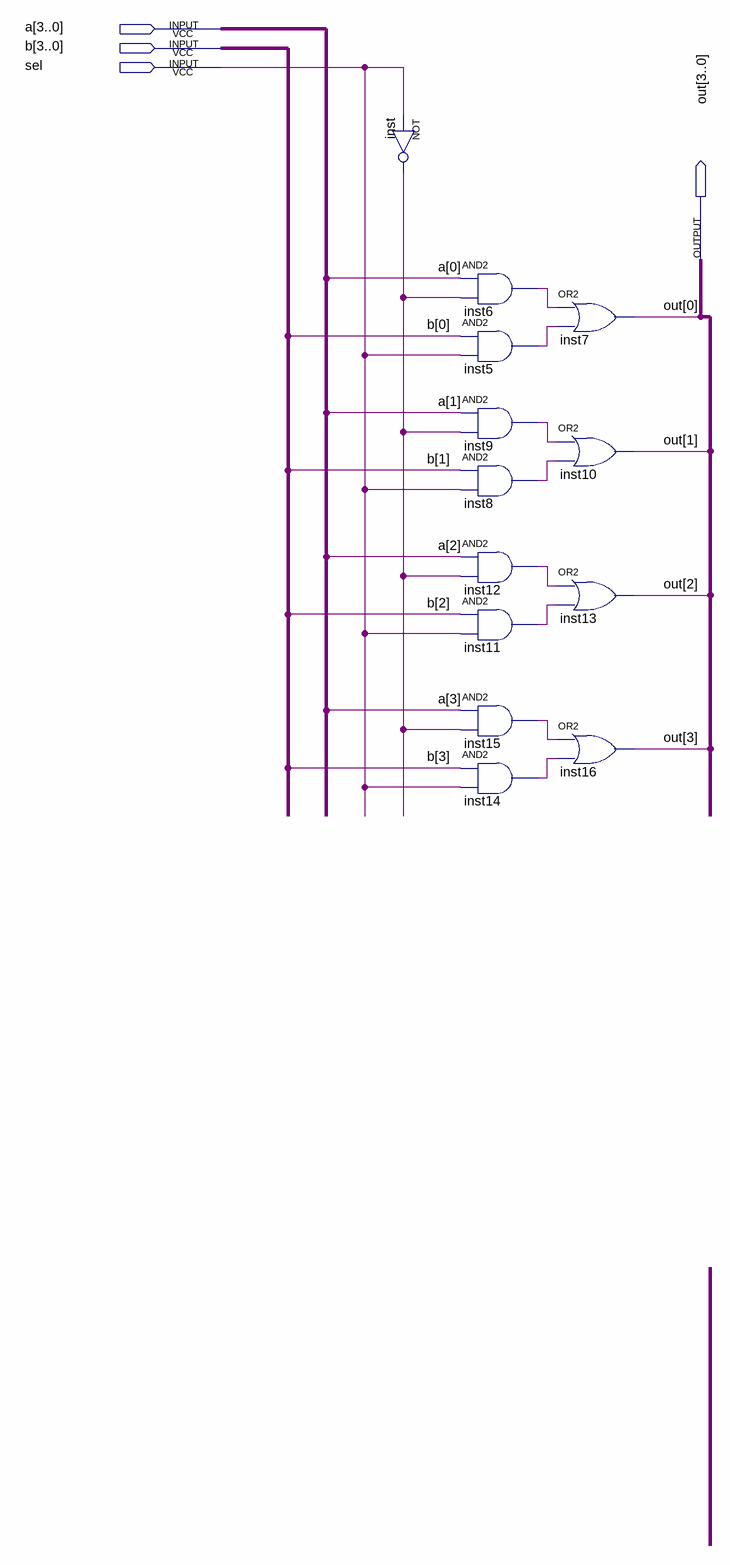
[diagram p0: schematic sheet]
// Quartus schematic 2bit_mux4.bdf as structural Verilog: 13 symbols, 4 pins
module \2bit_mux4  (
  input  [3:0] a,
  input  [3:0] b,
  input  sel,
  output [3:0] out
);

  wire inst5_out, inst6_out, inst8_out, inst9_out, inst11_out, inst12_out, inst14_out, inst15_out, inst_out;

  not inst (inst_out, sel);
  and inst6 (inst6_out, a[0], inst_out);
  and inst5 (inst5_out, b[0], sel);
  and inst9 (inst9_out, a[1], inst_out);
  and inst8 (inst8_out, b[1], sel);
  and inst12 (inst12_out, a[2], inst_out);
  and inst11 (inst11_out, b[2], sel);
  and inst15 (inst15_out, a[3], inst_out);
  and inst14 (inst14_out, b[3], sel);
  or inst7 (out[0], inst6_out, inst5_out);
  or inst10 (out[1], inst9_out, inst8_out);
  or inst13 (out[2], inst12_out, inst11_out);
  or inst16 (out[3], inst15_out, inst14_out);
endmodule
